# Altium schematic sheet S7CAS-PLEIADES-CARTE-MERE_P06_POWER_TREE.SchDoc
size Tabloid; SheetNumber: 3; SheetTotal: 18; Sheet_Name: POWER TREE; Size: 11x17
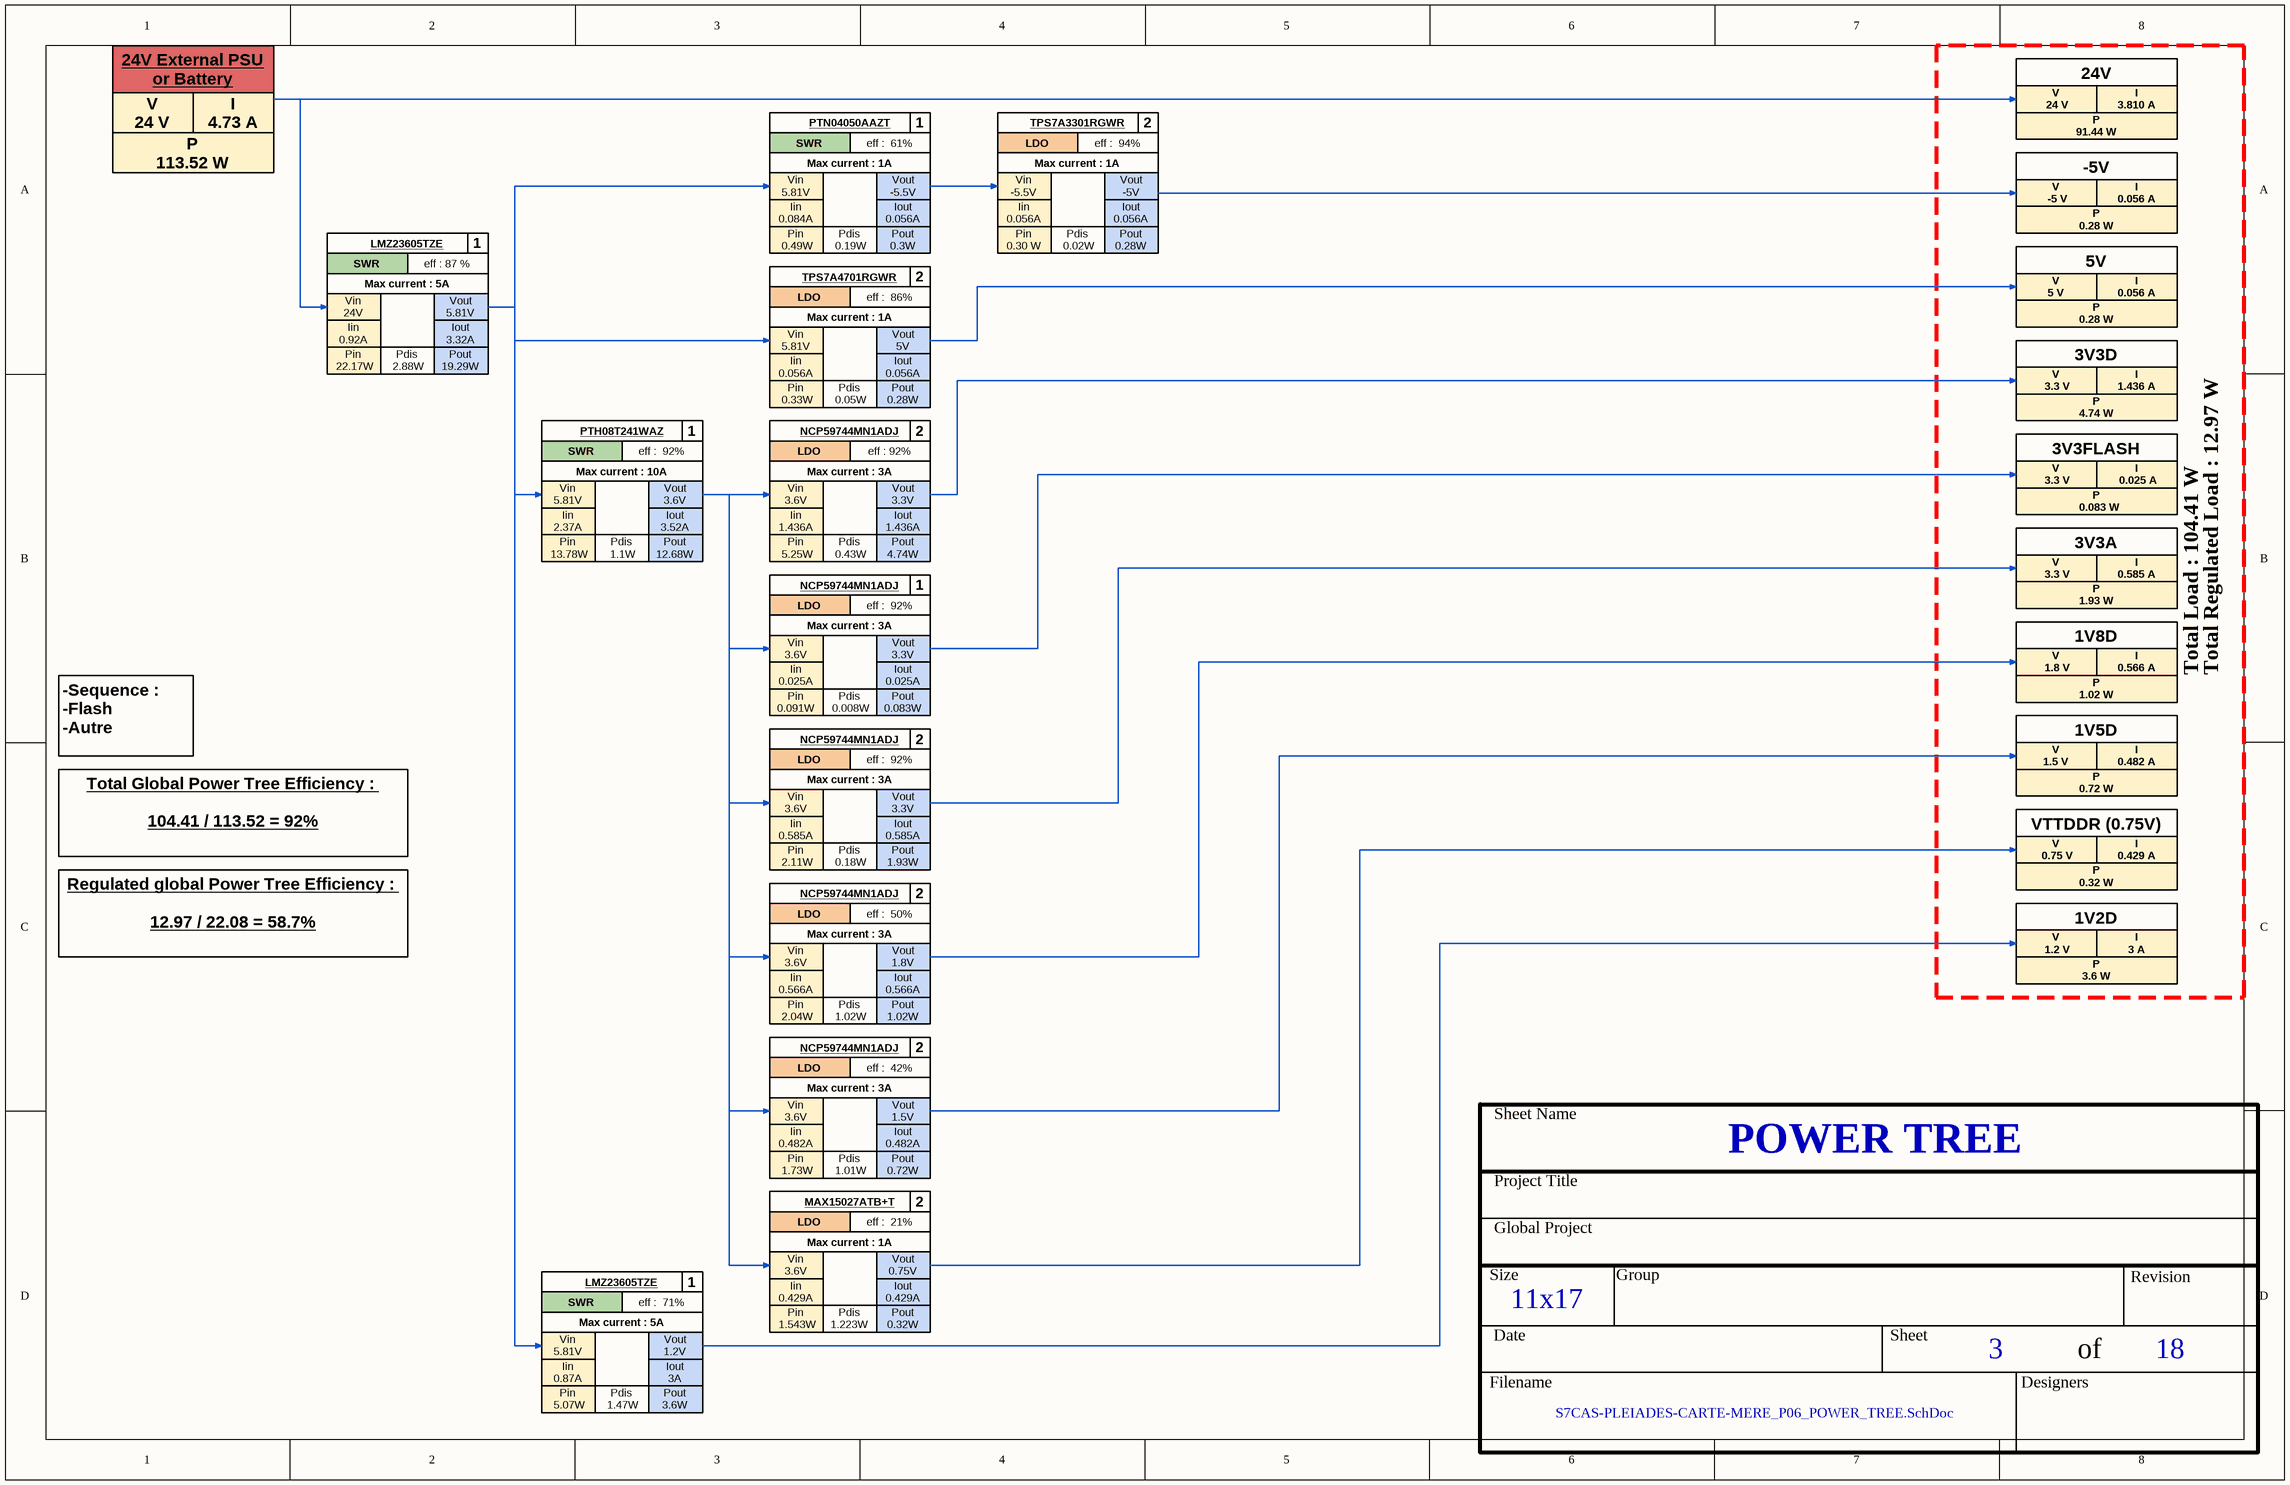
[diagram p0: S7CAS-PLEIADES-CARTE-MERE_P06_POWER_TREE.SchDoc]

## Notes on the sheet
- 24V External PSU
  or Battery
- 24V
- V
  24 V
- P
  113.52 W
- I
  4.73 A
- PTN04050AAZT
- SWR
- Max current : 1A
- eff :  61%
- 1
- LDO
- TPS7A3301RGWR
- eff :  94%
- 2
- P
  91.44 W
- I
  3.810 A
- Vin
  5.81V
- Iin
  0.084A
- Vout
  -5.5V
- Iout
  0.056A
- Vin
  -5.5V
- Iin
  0.056A
- Vout
  -5V
- -5V
- V
  -5 V
- P
  0.28 W
- I
  0.056 A
- LMZ23605TZE
- Max current : 5A
- eff : 87 %
- Pin
  0.49W
- TPS7A4701RGWR
- Pdis
  0.19W
- eff :  86%
- Pout
  0.3W
- Pin
  0.30 W
- Pdis
  0.02W
- Pout
  0.28W
- 5V
- V
  5 V
- Vin
  24V
- Iin
  0.92A
- Vout
  5.81V
- Iout
  3.32A
- Vout
  5V
- 3V3D
- Pin
  22.17W
- Pdis
  2.88W
- Pout
  19.29W
- PTH08T241WAZ
- Pin
  0.33W
- NCP59744MN1ADJ
- Pdis
  0.05W
- V
  3.3 V
- P
  4.74 W
- I
  1.436 A
- Max current : 10A
- eff :  92%
- Max current : 3A
- eff : 92%
- 3V3FLASH
- I
  0.025 A
- Iin
  2.37A
- Pin
  13.78W
- Pdis
  1.1W
- Vout
  3.6V
- Iout
  3.52A
- Pout
  12.68W
- Vin
  3.6V
- Iin
  1.436A
- Pin
  5.25W
- Pdis
  0.43W
- Vout
  3.3V
- Iout
  1.436A
- Pout
  4.74W
- 3V3A
- P
  0.083 W
- P
  1.93 W
- I
  0.585 A
- Iin
  0.025A
- Iout
  0.025A
- 1V8D
- V
  1.8 V
- P
  1.02 W
- I
  0.566 A
- Total Load : 104.41 W
- Total Regulated Load : 12.97 W
- -Sequence :
  -Flash
  -Autre
- Pin
  0.091W
- Pdis
  0.008W
- Pout
  0.083W
- 1V5D
- V
  1.5 V
- I
  0.482 A
- Iin
  0.585A
- Iout
  0.585A
- P
  0.72 W
- VTTDDR (0.75V)
- Total Global Power Tree Efficiency :
  104.41 / 113.52 = 92%
- Pin
  2.11W
- Pdis
  0.18W
- Pout
  1.93W
- V
  0.75 V
- P
  0.32 W
- I
  0.429 A
- Regulated global Power Tree Efficiency :
  12.97 / 22.08 = 58.7%
- eff :  50%
- Vout
  1.8V
- 1V2D
- V
  1.2 V
- I
  3 A
- Iin
  0.566A
- Pin
  2.04W
- Pdis
  1.02W
- Iout
  0.566A
- Pout
  1.02W
- P
  3.6 W
- eff :  42%
- Iin
  0.482A
- Vout
  1.5V
- Iout
  0.482A
- MAX15027ATB+T
- Pin
  1.73W
- Pdis
  1.01W
- eff :  21%
- Pout
  0.72W
- Iin
  0.429A
- Vout
  0.75V
- Iout
  0.429A
- eff :  71%
- Vout
  1.2V
- Pin
  1.543W
- Pdis
  1.223W
- Pout
  0.32W
- Iin
  0.87A
- Pin
  5.07W
- Pdis
  1.47W
- Iout
  3A
- Pout
  3.6W
- Sheet Name
- Project Title
- Global Project
- Size
- Group
- Revision
- Date
- Sheet
- of
- Filename
- Designers